# Altium schematic sheet Nordic_main.SchDoc
size A3
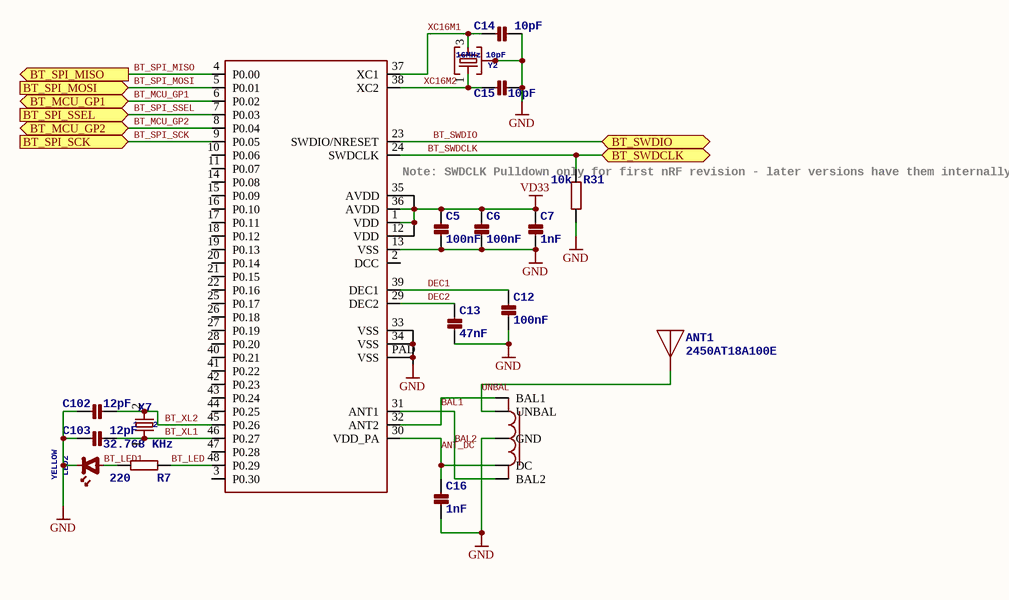
[diagram p0: Nordic_main.SchDoc]

## Parts
ANT1  2450AT18A100E  [1206_MINIMELF_COMBO]
BALUN  2450BM14A0002T  [6-PIN-0603]  (value not drawn)
BT  NRF51822QFN48  [QFN48_EP]  (value not drawn)
C5  100nF  [0402]
C6  100nF  [0402]
C7  1nF  [0402]
C12  100nF  [0402]
C13  47nF  [0402]
C14  10pF  [0402]
C15  10pF  [0402]
C16  1nF  [0402]
C102  12pF  [0402]
C103  12pF  [0402]
LED2  YELLOW  [0402_POLAR]
R7  220  [0402]
R31  10k  [0402]
X7  32.768 KHz  [1206_MINIMELF_COMBO]
Y2  16MHz 10pF  [CRYSTAL25X20]

## Ports
BT_MCU_GP1, BT_MCU_GP2, BT_SPI_MISO (out), BT_SPI_MOSI (in), BT_SPI_SCK (in), BT_SPI_SSEL (in), BT_SWDCLK, BT_SWDIO

## Nets
GND: BALUN.2(GND) BT.13(VSS) BT.33(VSS) BT.34(VSS) BT.PAD(VSS) C5.2 C6.2 C7.2 C12.2 C13.2 C14.2 C15.2 C16.2 C102.1 C103.1 LED2.K(CATHODE) R31.1 Y2.2 Y2.4
VD33: BT.1(VDD) BT.12(VDD) BT.35(AVDD) BT.36(AVDD) C5.1 C6.1 C7.1
ANT_DC: BALUN.5(DC) BT.30(VDD_PA) C16.1
BAL1: BALUN.3(BAL1) BT.32(ANT2)
BAL2: BALUN.4(BAL2) BT.31(ANT1)
BT_LED: BT.48(P0.29) R7.1
BT_LED1: LED2.A(ANODE) R7.2
BT_MCU_GP1: BT.6(P0.02) ; port BT_MCU_GP1
BT_MCU_GP2: BT.8(P0.04) ; port BT_MCU_GP2
BT_SPI_MISO: BT.4(P0.00) ; port BT_SPI_MISO
BT_SPI_MOSI: BT.5(P0.01) ; port BT_SPI_MOSI
BT_SPI_SCK: BT.9(P0.05) ; port BT_SPI_SCK
BT_SPI_SSEL: BT.7(P0.03) ; port BT_SPI_SSEL
BT_SWDCLK: BT.24(SWDCLK) R31.2 ; port BT_SWDCLK
BT_SWDIO: BT.23(SWDIO/NRESET) ; port BT_SWDIO
BT_XL1: BT.46(P0.27) C103.2 X7.1
BT_XL2: BT.45(P0.26) C102.2 X7.2
DEC1: BT.39(DEC1) C12.1
DEC2: BT.29(DEC2) C13.1
UNBAL: ANT1.1(ANT) BALUN.1(UNBAL)
XC16M1: BT.37(XC1) C14.1 Y2.3
XC16M2: BT.38(XC2) C15.1 Y2.1

Not connected (* = marked no-connect by the designer): BT 2(DCC) 3(P0.30) 10(P0.06) 11(P0.07) 14(P0.08) 15(P0.09) 16(P0.10) 17(P0.11) 18(P0.12) 19(P0.13) 20(P0.14) 21(P0.15) 22(P0.16) 25(P0.17) 26(P0.18) 27(P0.19) 28(P0.20) 40(P0.21) 41(P0.22) 42(P0.23) 43(P0.24) 44(P0.25) 47(P0.28)

## Notes on the sheet
- (near R31) Note: SWDCLK Pulldown only for first nRF revision - later versions have them internally

## Library data of the parts
ANT1 = ANTENNA_MONOPOLE1206: 2.45 GHz Antenna; SMD: Yes
BALUN = BALUN: 2.45 GHz Impedance Matched Balun-Filter; SMD: Yes
BT = NRF51822QFN48: Nordic Bluetooth 4.0 low energy modul; SMD: Yes
C5-C7 C12-C16 C102 C103 = CAP_CERAMIC0402: Ceramic Capacitor; SMD: Yes
LED2 = LED0402: LED common; SMD: Yes
R7 R31 = R-EU_0402: RESISTOR; SMD: Yes
X7 = CRYSTAL1206: CL05C120JB5; 1: 1; 2: 2; SMD: Yes
Y2 = CRYSTAL_WITH_GROUND25X20: 16MHz crystal 2.5x2mm; SMD: Yes